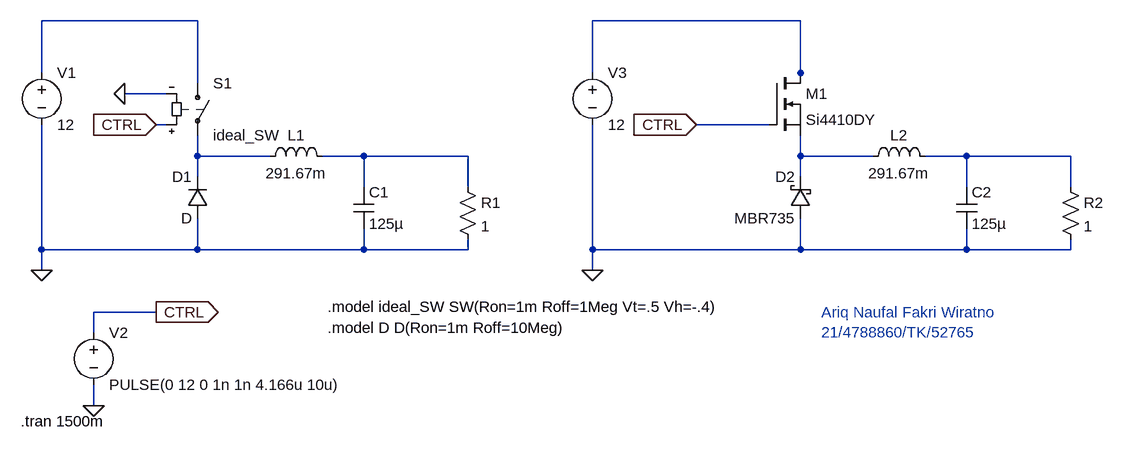
[diagram p0: schematic Buck_OL.asc]
Buck_OL.asc, the LTspice schematic file:
Version 4
SHEET 1 1736 680
WIRE 336 32 96 32
WIRE 1264 32 944 32
WIRE 96 112 96 32
WIRE 944 112 944 32
WIRE 1264 112 1264 32
WIRE 336 128 336 32
WIRE 1264 128 1264 112
WIRE 288 144 224 144
WIRE 288 192 272 192
WIRE 1216 192 1104 192
WIRE 336 240 336 208
WIRE 448 240 336 240
WIRE 592 240 528 240
WIRE 752 240 592 240
WIRE 1264 240 1264 208
WIRE 1376 240 1264 240
WIRE 1520 240 1456 240
WIRE 1680 240 1520 240
WIRE 336 272 336 240
WIRE 1264 272 1264 240
WIRE 592 288 592 240
WIRE 752 288 752 240
WIRE 1520 288 1520 240
WIRE 1680 288 1680 240
WIRE 96 384 96 192
WIRE 336 384 336 336
WIRE 336 384 96 384
WIRE 592 384 592 352
WIRE 592 384 336 384
WIRE 752 384 752 368
WIRE 752 384 592 384
WIRE 944 384 944 192
WIRE 1264 384 1264 336
WIRE 1264 384 944 384
WIRE 1520 384 1520 352
WIRE 1520 384 1264 384
WIRE 1680 384 1680 368
WIRE 1680 384 1520 384
WIRE 96 416 96 384
WIRE 944 416 944 384
WIRE 272 480 176 480
WIRE 176 512 176 480
WIRE 176 624 176 592
FLAG 272 192 CTRL
IOPIN 272 192 In
FLAG 272 480 CTRL
IOPIN 272 480 Out
FLAG 176 624 0
FLAG 96 416 0
FLAG 224 144 0
FLAG 1104 192 CTRL
IOPIN 1104 192 In
FLAG 944 416 0
SYMBOL voltage 96 96 R0
WINDOW 123 0 0 Left 0
WINDOW 39 0 0 Left 0
SYMATTR InstName V1
SYMATTR Value 12
SYMBOL ind 432 256 R270
WINDOW 0 32 56 VTop 2
WINDOW 3 5 56 VBottom 2
SYMATTR InstName L1
SYMATTR Value 291.67m
SYMBOL cap 576 288 R0
SYMATTR InstName C1
SYMATTR Value 125µ
SYMBOL res 736 272 R0
SYMATTR InstName R1
SYMATTR Value 1
SYMBOL voltage 176 496 R0
WINDOW 123 0 0 Left 0
WINDOW 39 0 0 Left 0
SYMATTR InstName V2
SYMATTR Value PULSE(0 12 0 1n 1n 4.166u 10u)
SYMBOL sw 336 112 R0
SYMATTR InstName S1
SYMATTR Value ideal_SW
SYMBOL diode 352 336 R180
WINDOW 0 24 64 Left 2
WINDOW 3 24 0 Left 2
SYMATTR InstName D1
SYMBOL nmos 1216 112 R0
SYMATTR InstName M1
SYMATTR Value Si4410DY
SYMBOL voltage 944 96 R0
WINDOW 123 0 0 Left 0
WINDOW 39 0 0 Left 0
SYMATTR InstName V3
SYMATTR Value 12
SYMBOL ind 1360 256 R270
WINDOW 0 32 56 VTop 2
WINDOW 3 5 56 VBottom 2
SYMATTR InstName L2
SYMATTR Value 291.67m
SYMBOL cap 1504 288 R0
SYMATTR InstName C2
SYMATTR Value 125µ
SYMBOL res 1664 272 R0
SYMATTR InstName R2
SYMATTR Value 1
SYMBOL schottky 1280 336 R180
WINDOW 0 24 64 Left 2
WINDOW 3 24 0 Left 2
SYMATTR InstName D2
SYMATTR Value MBR735
SYMATTR Description Diode
SYMATTR Type diode
TEXT 64 648 Left 2 !.tran 1500m
TEXT 536 472 Left 2 !.model ideal_SW SW(Ron=1m Roff=1Meg Vt=.5 Vh=-.4)
TEXT 536 504 Left 2 !.model D D(Ron=1m Roff=10Meg)
TEXT 1296 480 Left 2 ;Ariq Naufal Fakri Wiratno\n21/4788860/TK/52765

The netlist it stands for:
* Buck_OL.asc
V1 N001 0 12
L1 N003 N004 291.67m
C1 N004 0 125µ
R1 N004 0 1
V2 CTRL 0 PULSE(0 12 0 1n 1n 4.166u 10u)
S1 N001 N003 CTRL 0 ideal_SW
D1 0 N003 D
M1 N002 CTRL N005 N005 Si4410DY
V3 N002 0 12
L2 N005 N006 291.67m
C2 N006 0 125µ
R2 N006 0 1
D2 0 N005 MBR735
.model D D
.lib standard.dio
.model NMOS NMOS
.model PMOS PMOS
.lib standard.mos
.tran 1500m
.model ideal_SW SW(Ron=1m Roff=1Meg Vt=.5 Vh=-.4)
.model D D(Ron=1m Roff=10Meg)
* Ariq Naufal Fakri Wiratno
* 21/4788860/TK/52765
.backanno
.end